# Altium project Boost Converter.PrjPCB
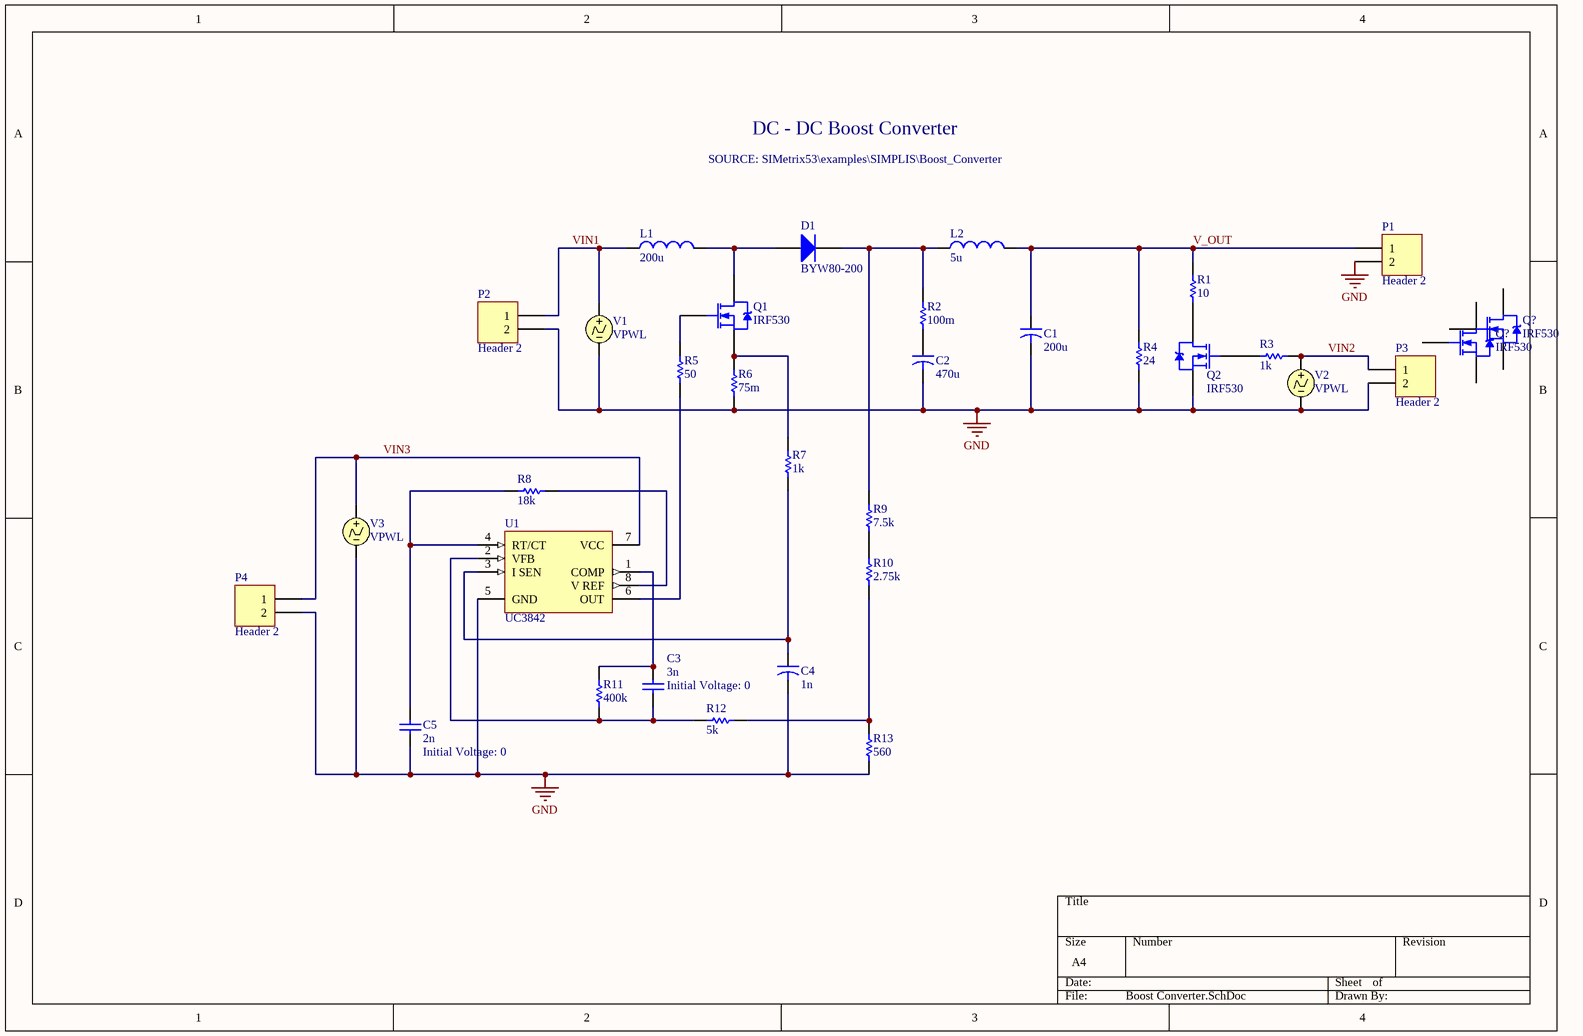
[diagram p0: Boost Converter.SchDoc]
1 sheet, 33 parts. Net scope: global (net labels, ports and power ports of the same name join across sheets).
Board file: Boost Converter.PcbDoc

## Sheet Boost Converter.SchDoc
size A4

### Parts
(Parts that share a designator on the sheet are numbered #1, #2 ... from top to bottom, then left to right.)
C1  CC: 200u  [CAPR5-4X5]  (hidden comment: Cap Elec (L1-3))
C2  CC: 470u  [CAPR5-4X5]  (hidden comment: Cap Elec (L1-3))
C3  value 3n  Initial Voltage: 0  [RAD-0.3]  (hidden comment: Cap)
C4  CC: 1n  [CAPR5-4X5]  (hidden comment: Cap Elec (L1-3))
C5  value 2n  Initial Voltage: 0  [RAD-0.3]  (hidden comment: Cap)
D1  BYW80-200  [SMC]
L1  value 200u  [0402-A]  (hidden comment: Lossy Inductor)
L2  value 5u  [0402-A]  (hidden comment: Lossy Inductor)
P1  Header 2  [HDR1X2]
P2  Header 2  [HDR1X2]
P3  Header 2  [HDR1X2]
P4  Header 2  [HDR1X2]
Q1  IRF530  [TO-220AB]
Q2  IRF530  [TO-220AB]
Q?#1  IRF530  [TO-220AB]
Q?#2  IRF530  [TO-220AB]
R1  value 10  [AXIAL-0.3]  (hidden comment: Res1)
R2  value 100m  [AXIAL-0.3]  (hidden comment: Res1)
R3  value 1k  [AXIAL-0.3]  (hidden comment: Res1)
R4  value 24  [AXIAL-0.3]  (hidden comment: Res1)
R5  value 50  [AXIAL-0.3]  (hidden comment: Res1)
R6  value 75m  [AXIAL-0.3]  (hidden comment: Res1)
R7  value 1k  [AXIAL-0.3]  (hidden comment: Res1)
R8  value 18k  [AXIAL-0.3]  (hidden comment: Res1)
R9  value 7.5k  [AXIAL-0.3]  (hidden comment: Res1)
R10  value 2.75k  [AXIAL-0.3]  (hidden comment: Res1)
R11  value 400k  [AXIAL-0.3]  (hidden comment: Res1)
R12  value 5k  [AXIAL-0.3]  (hidden comment: Res1)
R13  value 560  [AXIAL-0.3]  (hidden comment: Res1)
U1  UC3842  [SO8_L]
V1  VPWL  [HDR1X2H]
V2  VPWL  [HDR1X2H]
V3  VPWL  [HDR1X2H]

### Nets
GND: C1.2 C2.2 C4.2 C5.2 P1.2 P2.2 P3.2 P4.2 Q2.3(S) R4.2 R6.1 R13.1 U1.5(GND) V1.2 V2.2 V3.2
V_OUT: C1.1 L2.2 P1.1 R1.1 R4.1
VIN1: L1.1 P2.1 V1.1
VIN2: P3.1 R3.2 V2.1
VIN3: P4.1 U1.7(VCC) V3.1
NetC2_1: C2.1 R2.1
NetC3_1: C3.1 R11.2 U1.1(COMP)
NetC3_2: C3.2 R11.1 R12.2 U1.2(VFB)
NetC4_1: C4.1 R7.1 U1.3(I_SEN)
NetC5_1: C5.1 R8.2 U1.4(RT/CT)
NetD1_1: D1.1(A) L1.2 Q1.2(D)
NetD1_2: D1.2(K) L2.1 R2.2 R9.2
NetQ1_1: Q1.1(G) R5.2
NetQ1_3: Q1.3(S) R6.2 R7.2
NetQ2_1: Q2.1(G) R3.1
NetQ2_2: Q2.2(D) R1.2
NetR5_1: R5.1 U1.6(OUT)
NetR8_1: R8.1 U1.8(V_REF)
NetR9_1: R9.1 R10.2
NetR10_1: R10.1 R12.1 R13.2

Not connected (* = marked no-connect by the designer): Q?#1 1(G) 2(D) 3(S); Q?#2 1(G) 2(D) 3(S)

### Notes on the sheet
- DC - DC Boost Converter
- SOURCE: SIMetrix53\examples\SIMPLIS\Boost_Converter

### Library data of the parts
C1 = Cap Elec (L1-3): Electrolytic Capacitor (Levels 1-3); RSH_CC: 100Meg; RESR: 20m; LEVEL: 2; Published: 23-Sep-2002; PackageReference: CAPR5-4X5; Publisher: Altium Limited
C2 = Cap Elec (L1-3): Electrolytic Capacitor (Levels 1-3); LEVEL: 2; RSH_CC: 100Meg; RESR: 30m; Published: 23-Sep-2002; PackageReference: CAPR5-4X5; Publisher: Altium Limited
C3 C5 = Cap: Capacitor; Published: 8-Jun-2000; LatestRevisionDate: 17-Jul-2002; LatestRevisionNote: Re-released for DXP Platform.; PackageReference: RAD-0.3; Publisher: Altium Limited
C4 = Cap Elec (L1-3): Electrolytic Capacitor (Levels 1-3); RSH_CC: 1G; RESR: 50; LEVEL: 2; Published: 23-Sep-2002; PackageReference: CAPR5-4X5; Publisher: Altium Limited
D1 = BYW80-200: High-Efficiency Fast Recovery Rectifier Diode; Published: 8-Jun-2000; LatestRevisionDate: 17-Jul-2002; LatestRevisionNote: Re-released for DXP Platform.; PackageDocument: Sep-1996; PackageReference: SMC; Publisher: Altium Limited; Code_JEDEC: DO-214-AB
L1 L2 = Inductor (Lossy): Code_IEC: 1005; RSERIES: 10m; RSHUNT: 1G; Published: 8-Jun-2000; LatestRevisionDate: 17-Jul-2002; LatestRevisionNote: Re-released for DXP Platform.; PackageReference: 0402-A; Publisher: Altium Limited; Code_JEITA: 0402
P1-P4 = Header 2: Header, 2-Pin; LatestRevisionDate: 17-Jul-2002; LatestRevisionNote: Re-released for DXP Platform.; Publisher: Altium Limited
Q1 Q2 Q?#1 Q?#2 = IRF530: HEXFET N-Channel Power MOSFET; Note: Pin 2 is electrically connected to pin 4.; Published: 8-Jun-2000; LatestRevisionDate: 17-Jul-2002; LatestRevisionNote: Re-released for DXP Platform.; DatasheetVersion: PD-9.307O; PackageVersion: Feb-1997; PackageReference: TO-220AB; Publisher: Altium Limited; PackageDescription: TO, Thru-Hole, Vertical, Heatsink Mounted; 3 In-Line Leads; Pitch 2.54 mm; ComponentLink1Description: Manufacturer Link; ComponentLink1URL: http://www.irf.com/; ComponentLink2Description: Datasheet; ComponentLink2URL: http://www.irf.com/product-info/datasheets/data/irf530.pdf
R1-R13 = Res1: Resistor; Published: 8-Jun-2000; LatestRevisionDate: 17-Jul-2002; LatestRevisionNote: Re-released for DXP Platform.; PackageReference: AXIAL-0.3; Publisher: Altium Limited
U1 = UC3842: High-Performance Current Mode PWM Controller; Published: 24-Aug-2001; LatestRevisionDate: 13-Apr-2006; LatestRevisionNote: IPC-7351 Footprint Added.; DatasheetVersion: Mar-1999; PackageVersion: Dec-2002; PackageReference: SO8; Publisher: Altium Limited; PackageDescription: 8-Pin Small Outline Integrated Circuit 1.27 mm Pitch; Code_JEDEC: MS-012-AA; Code_IPC: SOIC127P600-8; ComponentLink1Description: Manufacturer Link; ComponentLink1URL: http://www.st.com/; ComponentLink2Description: Datasheet; ComponentLink2URL: http://www.st.com/stonline/products/literature/ds/4299/uc3842b.pdf
V1-V3 = VPWL: Piecewise Linear Voltage Source; Note: PCB Footprint - Not required; Sim Note: To add model file containing time-current pairs of values, enter model location under "General Tab" in "Full Path" box.; Published: 8-Jun-2000; LatestRevisionDate: 17-Jul-2002; LatestRevisionNote: Re-released for DXP Platform.; PackageReference: Not Applicable; Publisher: Altium Limited